# Altium project Input_board.PrjPCB
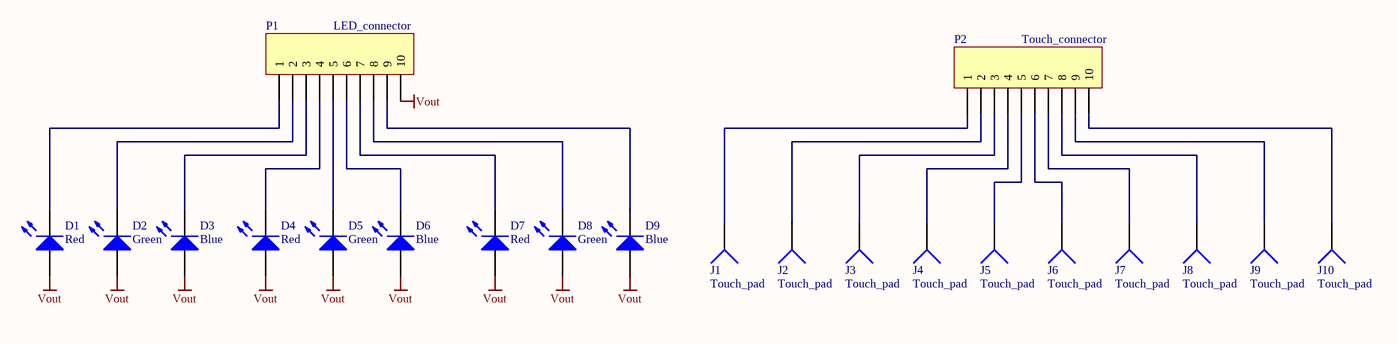
[diagram p0: Input_board.SchDoc]
1 sheet, 21 parts. Net scope: global (net labels, ports and power ports of the same name join across sheets).
Board file: Input_board.PcbDoc

## Sheet Input_board.SchDoc
size A4

### Parts
D1  Red  [0603]
D2  Green  [0603]
D3  Blue  [0603]
D4  Red  [0603]
D5  Green  [0603]
D6  Blue  [0603]
D7  Red  [0603]
D8  Green  [0603]
D9  Blue  [0603]
J1  Touch_pad  [Cap_Slider]
J2  Touch_pad  [Cap_Slider]
J3  Touch_pad  [Cap_Slider]
J4  Touch_pad  [Cap_Slider]
J5  Touch_pad  [Cap_Slider]
J6  Touch_pad  [Cap_Slider]
J7  Touch_pad  [Cap_Slider]
J8  Touch_pad  [Cap_Slider]
J9  Touch_pad  [Cap_Slider]
J10  Touch_pad  [Cap_Slider]
P1  LED_connector  [User_interface_10pin_connector]
P2  Touch_connector  [User_interface_10pin_connector]

### Nets
Vout: D1.1(A) D2.1(A) D3.1(A) D4.1(A) D5.1(A) D6.1(A) D7.1(A) D8.1(A) D9.1(A) P1.10
NetD1_2: D1.2(K) P1.1
NetD2_2: D2.2(K) P1.2
NetD3_2: D3.2(K) P1.3
NetD4_2: D4.2(K) P1.4
NetD5_2: D5.2(K) P1.5
NetD6_2: D6.2(K) P1.6
NetD7_2: D7.2(K) P1.7
NetD8_2: D8.2(K) P1.8
NetD9_2: D9.2(K) P1.9
NetJ1_1: J1.1 P2.1
NetJ2_1: J2.1 P2.2
NetJ3_1: J3.1 P2.3
NetJ4_1: J4.1 P2.4
NetJ5_1: J5.1 P2.5
NetJ6_1: J6.1 P2.6
NetJ7_1: J7.1 P2.7
NetJ8_1: J8.1 P2.8
NetJ9_1: J9.1 P2.9
NetJ10_1: J10.1 P2.10

### Library data of the parts
D1-D9 = LED0: Typical INFRARED GaAs LED; Published: 8-Jun-2000; LatestRevisionDate: 08-Jul-2005; LatestRevisionNote: Mech Layer 1 removed.; PackageReference: LED-0; Publisher: Altium Limited; PackageDescription: LED; 2 Leads
J1-J10 = Socket: LatestRevisionDate: 17-Jul-2002; LatestRevisionNote: Re-released for DXP Platform.; Publisher: Altium Limited
P1 P2 = Header 10: Header, 10-Pin; LatestRevisionDate: 17-Jul-2002; LatestRevisionNote: Re-released for DXP Platform.; Publisher: Altium Limited